# EasyEDA Pro project ProProject_PassiveFilter_BP_Ver0.1_2023-07-24.epro

# Schematic Schematic1
Create Date: 2023-07-23; Page Name: P1; Project Name: XTAL_LO_Ver0.1; Schematic Name: Schematic1; Update Date: 2023-07-23; Company: 嘉立创EDA; Page Size: A5; Version: V1.0
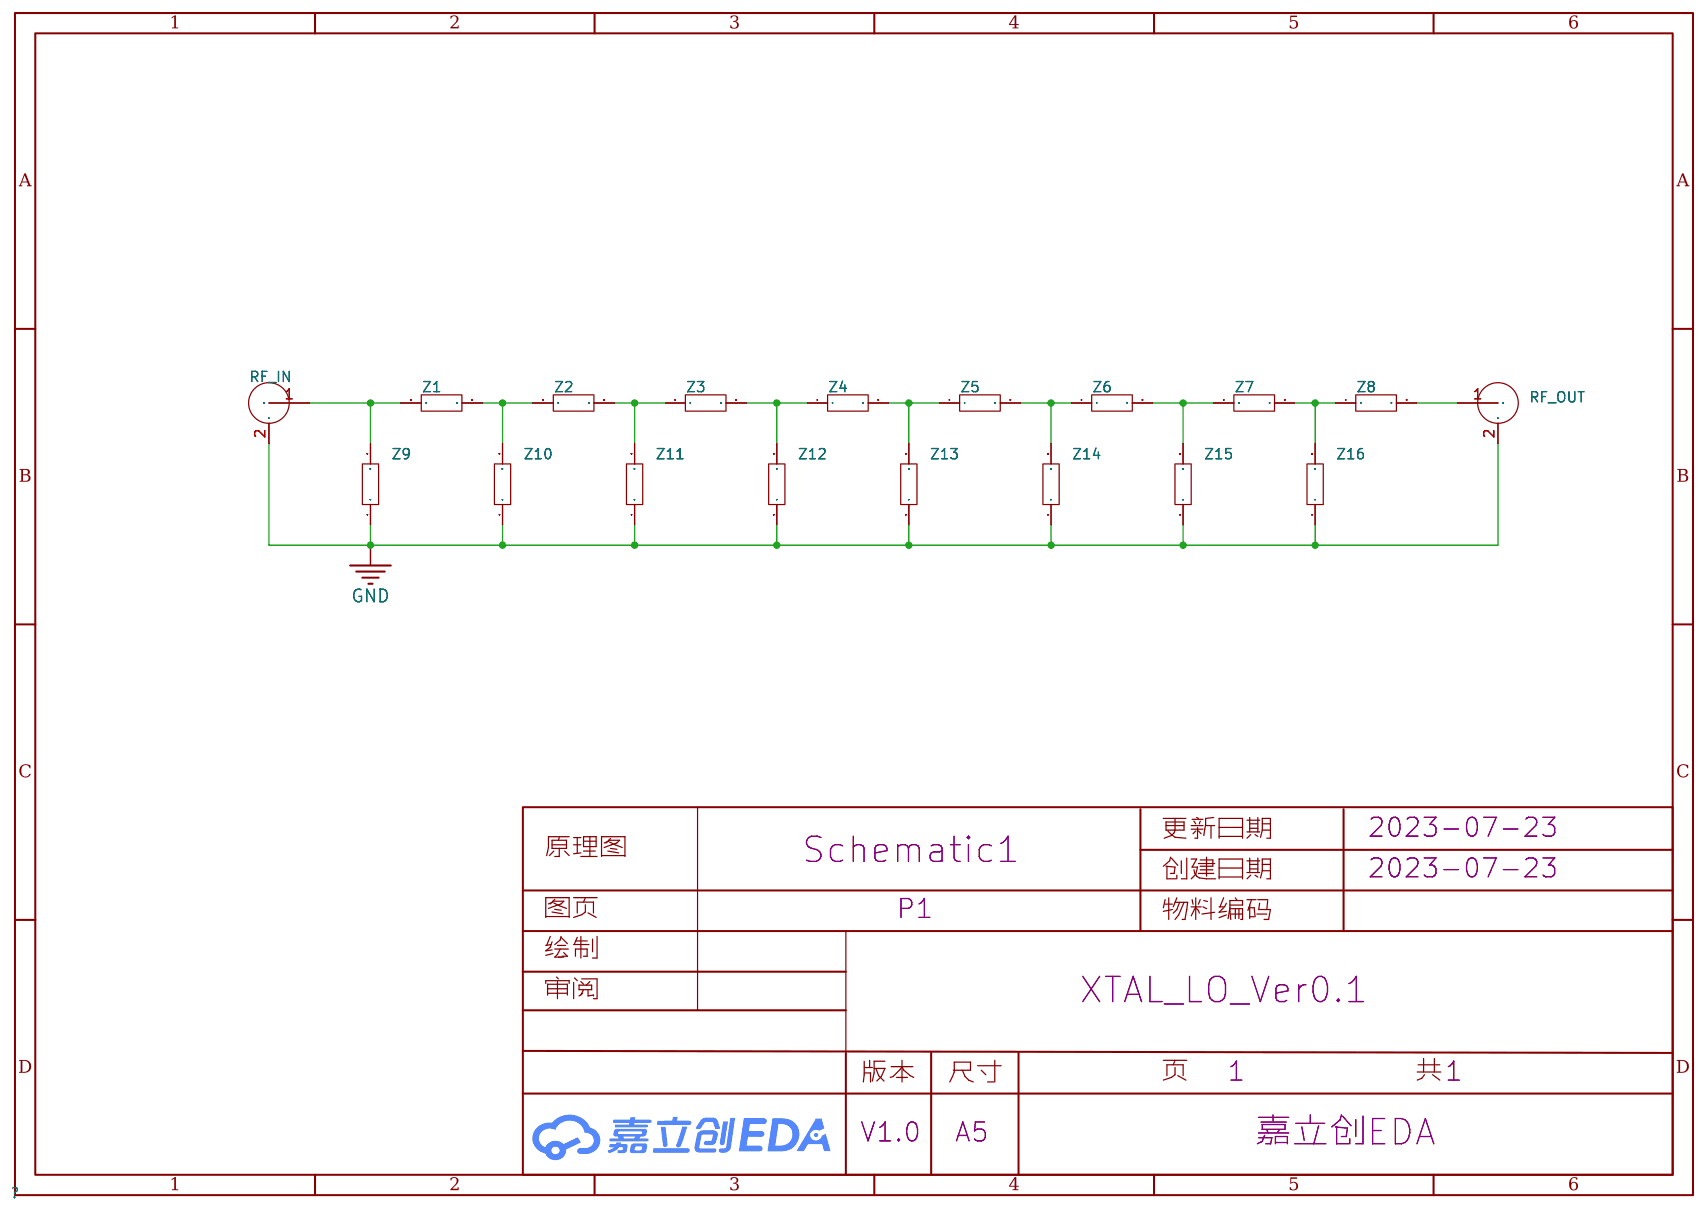
[diagram p0: schematic sheet]

## Parts
RF_IN  -  [SMA-SMD_BWSMA-KE-P001]
RF_OUT  -  [SMA-SMD_BWSMA-KE-P001]
Z1  10K  [R0603]
Z2  10K  [R0603]
Z3  10K  [R0603]
Z4  10K  [R0603]
Z5  10K  [R0603]
Z6  10K  [R0603]
Z7  10K  [R0603]
Z8  10K  [R0603]
Z9  10K  [R0603]
Z10  10K  [R0603]
Z11  10K  [R0603]
Z12  10K  [R0603]
Z13  10K  [R0603]
Z14  10K  [R0603]
Z15  10K  [R0603]
Z16  10K  [R0603]

## Library data of the parts
RF_IN RF_OUT = SMA: 连接器类型:板端;射频系列:SMA;接口类型:内孔;端口数量:1;阻抗:-;频率-最大值:-;样式:偏脚;接口直径:5.2mm;接口长度/高度:-;工作温度范围:-;; LCSC Part Name: SMA内孔偏脚; Supplier Part: C496550; Manufacturer: BATWIRELESS(蝙蝠无线); Manufacturer Part: BWSMA-KE-P001; Supplier Footprint: 插件; JLCPCB Part Class: ExtendedPart; Datasheet: https://atta.szlcsc.com/upload/public/pdf/source/20200416/C496550_06668BF2E3B968EA39F96D17E7156373.pdf; Supplier: LCSC; Connector Type: 板端; Interface Type: 内孔; Number of Ports: 1; Style: 偏脚; Interface Diameter: 5.2mm
Z1-Z16 = Res_0603: Supplier Footprint: 0603

## Nets
GND: RF_IN.2 RF_OUT.2 Z9.1 Z10.1 Z11.1 Z12.1 Z13.1 Z14.1 Z15.1 Z16.1
$1N722: Z1.2 Z2.1 Z10.2
$1N729: Z2.2 Z3.1 Z11.2
$1N736: Z3.2 Z4.1 Z12.2
$1N743: Z4.2 Z5.1 Z13.2
$1N750: Z5.2 Z6.1 Z14.2
$1N763: Z6.2 Z7.1 Z15.2
$1N792: Z7.2 Z8.1 Z16.2
$1N992: RF_OUT.1 Z8.2
$1N1005: RF_IN.1 Z1.1 Z9.2

# Board PCB1
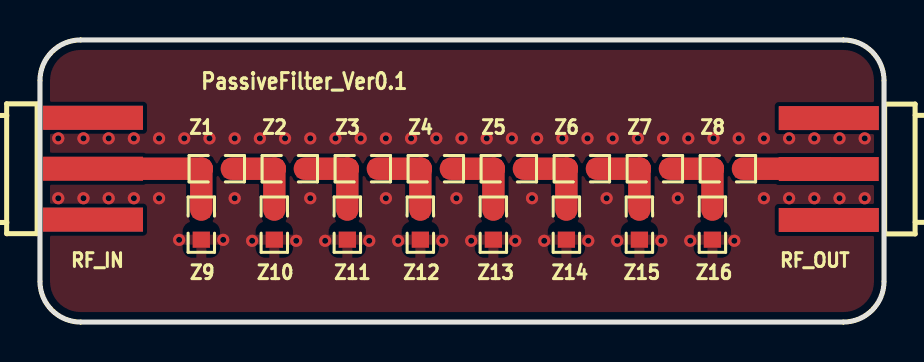
[diagram p1: board, top side]
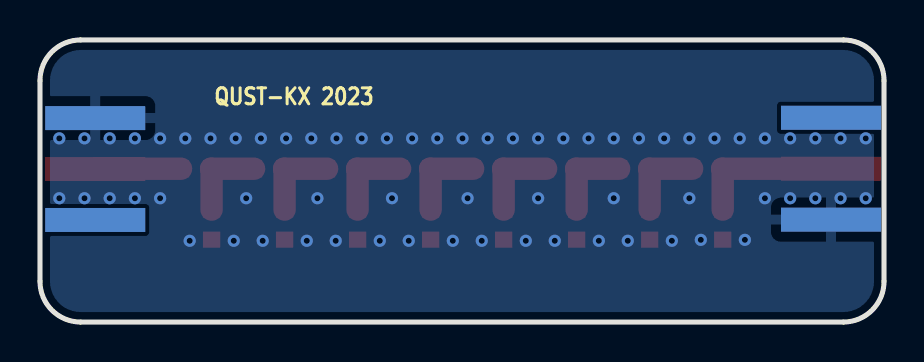
[diagram p2: board, bottom side, seen from below]

Outline 42.22 x 14.12 mm; copper layers: Top Layer, Bottom Layer. Coordinates in mm from the lower left corner of the outline.
Outline path: 0,12.09 0,2.03 arc(0.6,0.6) 2.03,0 40.18,0 arc(41.62,0.6) 42.22,2.03 42.22,12.09 arc(41.62,13.53) 40.18,14.12 2.03,14.12 arc(0.6,13.53) 0,12.09
Stack: Top Layer 0.035mm / Dielectric1 1.51mm FR4 er 4.5 / Bottom Layer 0.035mm

## Design rules (mm)
template: 自定义配置
spacing copperThickness1oz (default): track to track 0.102, other pairs 0.152 to 0.3
spacing copperThickness2oz: track to track 0.203, other pairs 0.152 to 0.3
track width copperThickness1oz (default): min 0.127, default 1.12, max 2.54
track width copperThickness2oz: min 0.203, default 0.254, max 2.54
differential pair differentialPair (default): width min 0.127, default 0.254, max 2.54; gap min 0.152, default 0.152
via viaSize (default): diameter min 0.5, default 0.61, max 10; hole min 0.3, default 0.305, max 6.299

## Placement (name value [footprint] x y rotation side)
RF_IN  -  [SMA-SMD_BWSMA-KE-P001]  2.65 7.68 180 top
RF_OUT  -  [SMA-SMD_BWSMA-KE-P001]  39.45 7.66 0 top
U1  -  [客编]  11.53 2.03 180 bottom
Z1  10K  [R0603]  8.84 7.68 0 top
Z2  10K  [R0603]  12.5 7.68 0 top
Z3  10K  [R0603]  16.15 7.68 0 top
Z4  10K  [R0603]  19.8 7.68 0 top
Z5  10K  [R0603]  23.45 7.68 0 top
Z6  10K  [R0603]  27.1 7.68 0 top
Z7  10K  [R0603]  30.76 7.68 0 top
Z8  10K  [R0603]  34.41 7.68 0 top
Z9  10K  [R0603]  8.07 4.88 90 top
Z10  10K  [R0603]  11.72 4.88 90 top
Z11  10K  [R0603]  15.37 4.88 90 top
Z12  10K  [R0603]  19.02 4.88 90 top
Z13  10K  [R0603]  22.68 4.88 90 top
Z14  10K  [R0603]  26.33 4.88 90 top
Z15  10K  [R0603]  29.98 4.88 90 top
Z16  10K  [R0603]  33.63 4.88 90 top

## Footprints (pads in the part's own frame, mm; a bottom-side part is the same pattern mirrored in y, then rotated)
R0603
  rect 0.806x0.864 smd: 1(-0.753,0) 2(0.753,0)
SMA-SMD_BWSMA-KE-P001
  rect 5x1.2 smd: 1(0,0) 2(0,2.55) 2(0,-2.55)
  rect 5x1.2 smd far side: 2(0,2.55) 2(0,-2.55)

## Nets
As in the schematic.

## Via types
v1: diameter 0.61, hole 0.305, Top Layer to Bottom Layer, 66 vias

## Routing (per net, layer and track width the routed paths; a pad name or vN(x,y) marks a point on that pad's centre or on a via; arc(x,y) is an arc through that point)
GND:
  vias: v1(0.91,9.19) v1(0.91,6.2) v1(2.17,9.19) v1(2.17,6.2) v1(3.44,9.19) v1(3.44,6.2) v1(4.7,9.19) v1(4.7,6.2) v1(5.96,9.19) v1(5.96,6.2) v1(6.96,4.11) v1(7.22,9.19) v1(8.48,9.19) v1(9.16,4.11) v1(9.74,9.19) v1(9.74,6.2) v1(10.61,4.07) v1(11,9.19) v1(12.26,9.19) v1(12.82,4.07) v1(13.52,9.19) v1(13.52,6.2) v1(14.26,4.07) v1(14.78,9.19) v1(16.04,9.19) v1(16.47,4.07) v1(17.3,9.19) v1(17.3,6.2) v1(17.92,4.07) v1(18.56,9.19) v1(19.82,9.19) v1(20.12,4.07) v1(20.83,6.2) v1(21.08,9.19) v1(21.57,4.07) v1(22.34,9.19) v1(23.6,9.19) v1(23.77,4.07) v1(24.61,6.2) v1(24.86,9.19) v1(25.22,4.07) v1(26.12,9.19) v1(27.38,9.19) v1(27.42,4.07) v1(28.34,6.2) v1(28.65,9.19) v1(28.87,4.07) v1(29.91,9.19) v1(31.08,4.07) v1(31.17,9.19) v1(31.9,6.2) v1(32.43,9.19) v1(32.52,4.07) v1(33.69,9.19) v1(34.73,4.07) v1(34.95,9.19) v1(36.21,9.19) v1(36.21,6.2) v1(37.47,9.19) v1(37.47,6.2) v1(38.73,9.19) v1(38.73,6.2) v1(39.99,9.19) v1(39.99,6.2) v1(41.25,9.19) v1(41.25,6.2)
$1N722: length 4.2
  Top Layer w1.12: Z10.2 11.72,7.65 Z2.1 Z1.2
$1N729: length 4.2
  Top Layer w1.12: Z2.2 Z3.1 15.37,7.65 Z11.2
$1N736: length 4.2
  Top Layer w1.12: Z12.2 19.02,7.65 Z4.1 Z3.2
$1N743: length 4.2
  Top Layer w1.12: Z4.2 Z5.1 22.68,7.65 Z13.2
$1N750: length 4.2
  Top Layer w1.12: Z5.2 Z6.1 26.33,7.65 Z14.2
$1N763: length 4.2
  Top Layer w1.12: Z15.2 29.98,7.65 Z7.1 Z6.2
$1N792: length 4.2
  Top Layer w1.12: Z16.2 33.63,7.65 Z8.1 Z7.2
$1N992: length 4.3
  Top Layer w1.12: Z8.2 39.44,7.68 RF_OUT.1
$1N1005: length 7.5
  Top Layer w1.12: RF_IN.1 Z1.1 8.07,7.65 Z9.2

## Copper pours and planes (outline as drawn; the poured copper is in the pictures)
GND on Top Layer: 0,14.12 42.22,14.12 42.22,0 0,0
GND on Bottom Layer: 0,14.12 42.42,14.12 42.42,0 0,0

## Text on the board
Bottom Silkscreen Layer: QUST-KX 2023
Top Silkscreen Layer: PassiveFilter_Ver0.1
